# EAGLE schematic ibmpc (EAGLE 9.6.1)
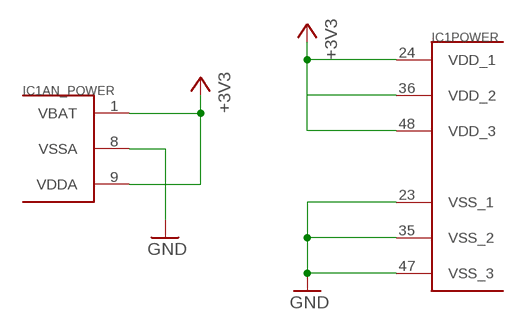
[diagram p0: schematic, sheet 1, part 1 of 2]
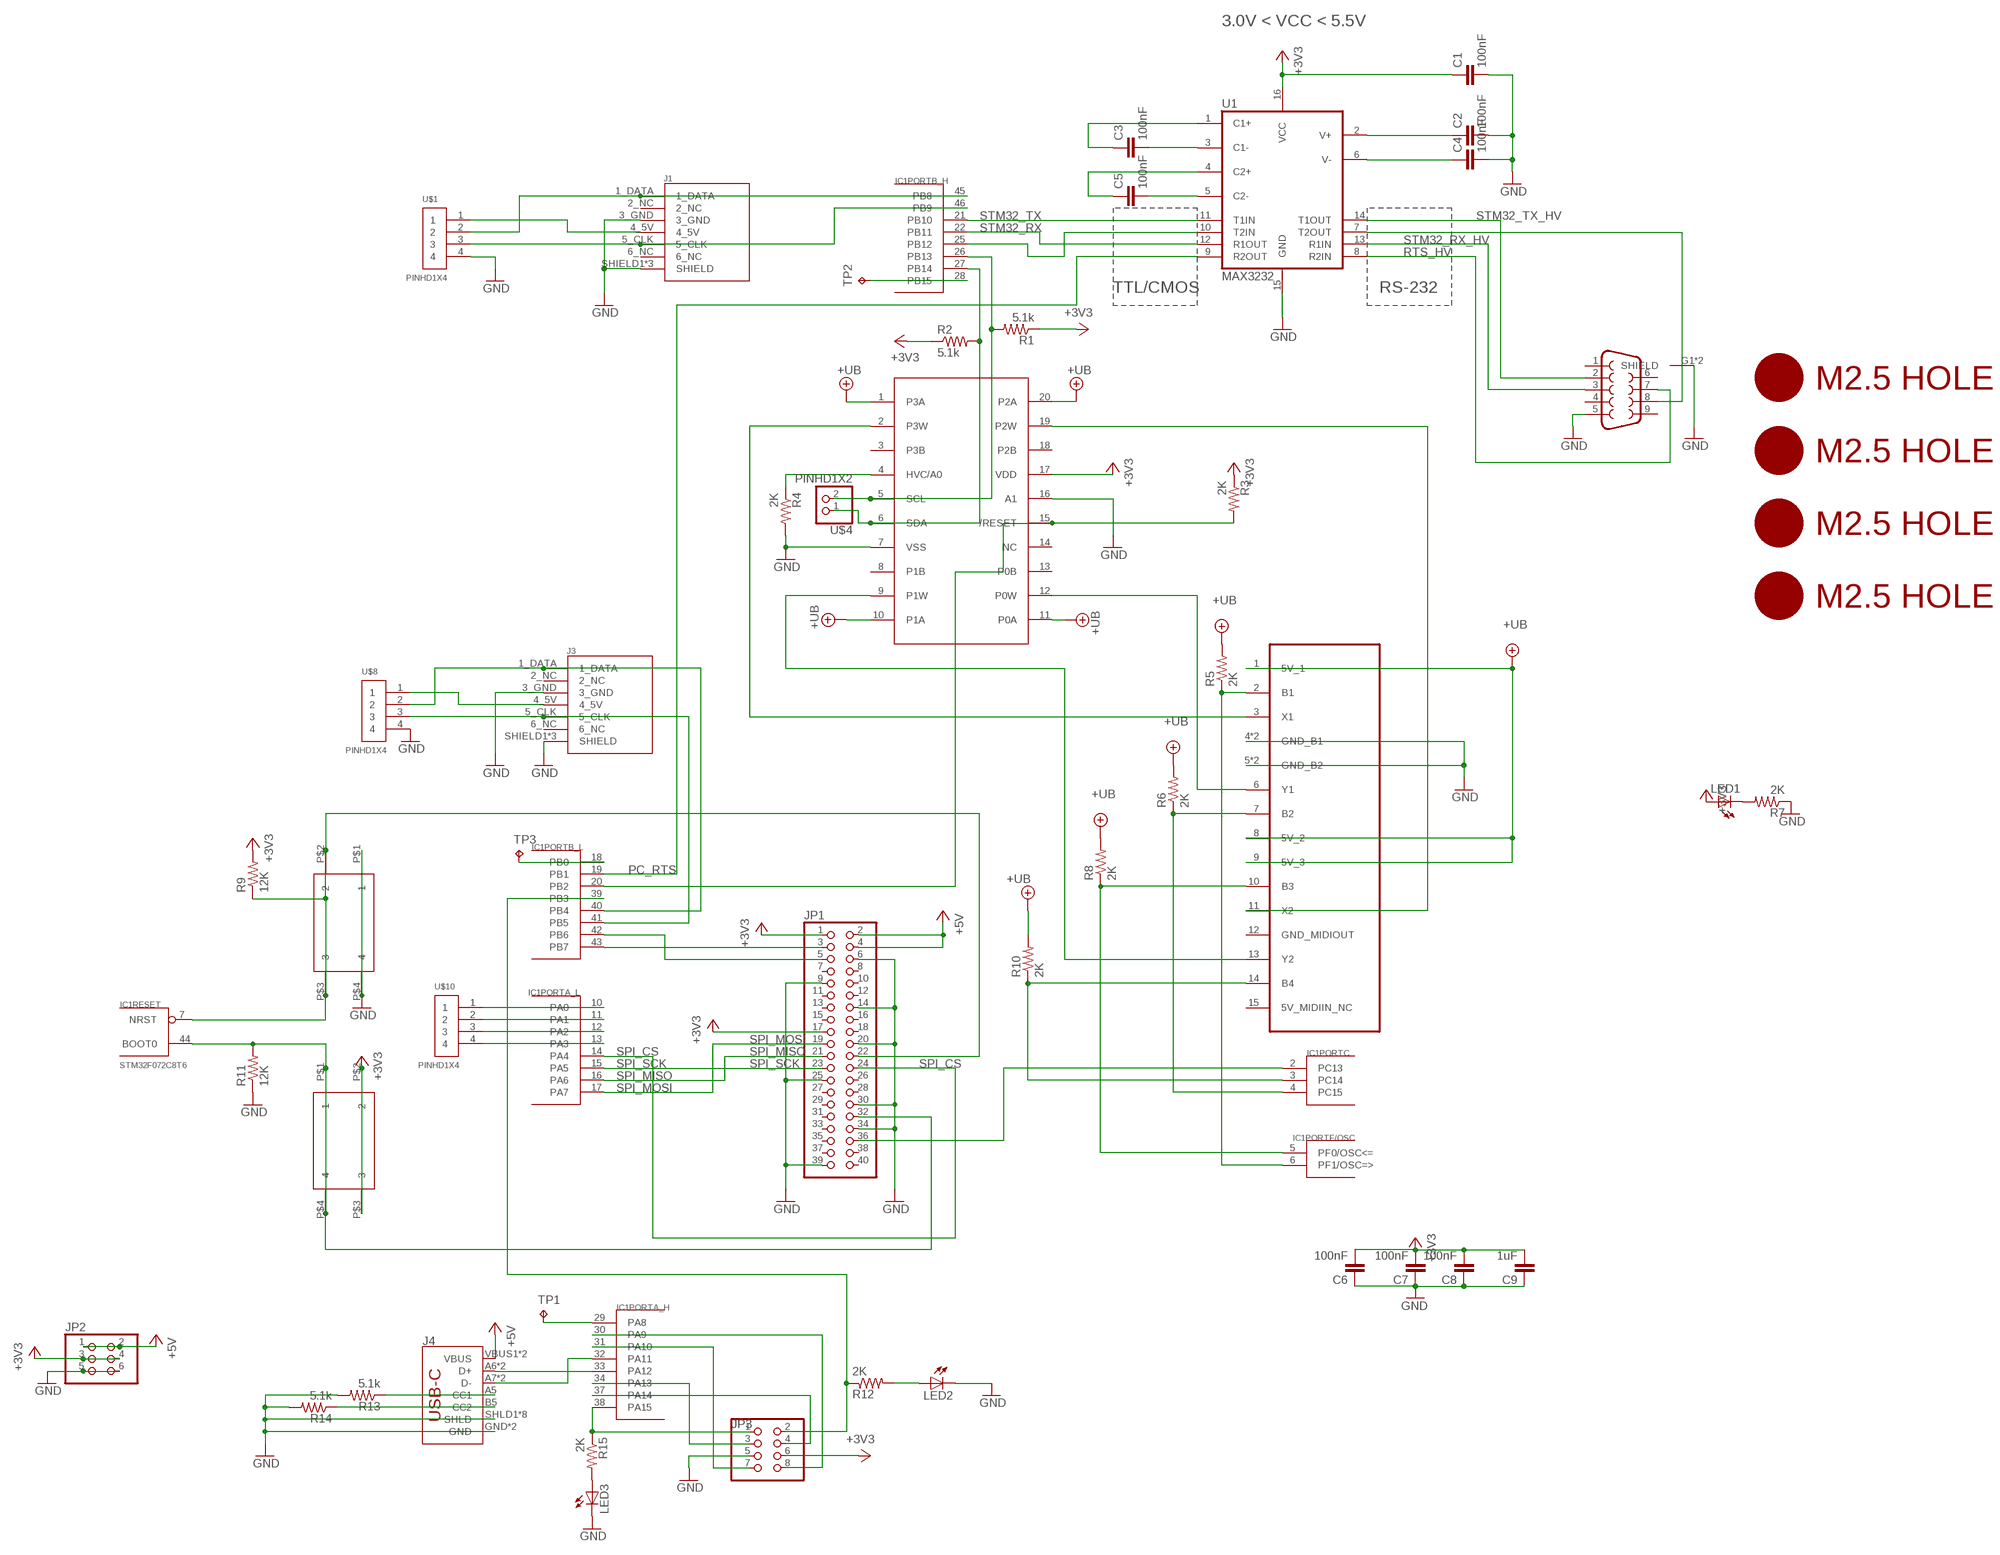
[diagram p1: schematic, sheet 1, part 2 of 2]

## Parts
C1  100nF  CAP0805  [0805@1]
C2  100nF  CAP0805  [0805@1]
C3  100nF  CAP0805  [0805@1]
C4  100nF  CAP0805  [0805@1]
C5  100nF  CAP0805  [0805@1]
C6  100nF  CAP0805  [0805@1]
C7  100nF  CAP0805  [0805@1]
C8  100nF  CAP0805  [0805@1]
C9  1uF  CAP0805  [0805@1]
IC1  STM32F072C8T6  [TQFP48]
J1  DIN7  [DIN7]
J2  DB9MALE  [DB9_MALE]
J3  DIN7  [DIN7]
J4  USB_C16PIN  [USB-C-16P]
JP1  PINHD-2X20-BIG  [2X20-BIG]
JP2  PINHD-2X3  [2X03]
JP3  PINHD-2X4  [2X04]
LED1  LEDCHIP-LED0805  [CHIP-LED0805]
LED2  LEDCHIP-LED0805  [CHIP-LED0805]
LED3  LEDCHIP-LED0805  [CHIP-LED0805]
R1  5.1k  RESISTOR0805-RES  [0805]
R2  5.1k  RESISTOR0805-RES  [0805]
R3  2K  RESISTOR0805-RES  [0805]
R4  2K  RESISTOR0805-RES  [0805]
R5  2K  RESISTOR0805-RES  [0805]
R6  2K  RESISTOR0805-RES  [0805]
R7  2K  RESISTOR0805-RES  [0805]
R8  2K  RESISTOR0805-RES  [0805]
R9  12K  RESISTOR0805-RES  [0805]
R10  2K  RESISTOR0805-RES  [0805]
R11  12K  RESISTOR0805-RES  [0805]
R12  2K  RESISTOR0805-RES  [0805]
R13  5.1k  RESISTOR0805-RES  [0805]
R14  5.1k  RESISTOR0805-RES  [0805]
R15  2K  RESISTOR0805-RES  [0805]
SW1  324_SW  [342_SWICH_FOOT]
SW2  324_SW  [342_SWICH_FOOT]
TP1  TPTP12R  [TP12R]
TP2  TPTP12R  [TP12R]
TP3  TPTP12R  [TP12R]
U1  MAX3232  MAX232SOIC16  [SO016]
U$1  PINHD1X4  [1X04-CLEANBIG]
U$2  M2.5HOLE  [M2.5HOLE]
U$3  M2.5HOLE  [M2.5HOLE]
U$4  PINHD1X2  [1X02]
U$5  MCP4451  [TSSOP20]
U$6  M2.5HOLE  [M2.5HOLE]
U$7  M2.5HOLE  [M2.5HOLE]
U$8  PINHD1X4  [1X04-CLEANBIG]
U$9  GAMEPORT_15P  [DA15]
U$10  PINHD1X4  [1X04-CLEANBIG]

## Nets
+3V3: C1.1 C6.2 C7.2 C8.2 C9.2 IC1.1(AN_POWER:VBAT) IC1.9(AN_POWER:VDDA) IC1.24(POWER:VDD_1) IC1.36(POWER:VDD_2) IC1.48(POWER:VDD_3) JP1.1 JP1.17 JP2.3 JP2.4 JP3.6 LED1.A R1.1 R2.1 R3.1 R9.2 SW2.P$2 SW2.P$3 U1.16(VCC) U$5.17(VDD)
+5V: J4.VBUS1(VBUS) J4.VBUS2(VBUS) JP1.2 JP1.4 JP2.1 JP2.2
+UB: R5.2 R6.2 R8.2 R10.2 U$5.1(P3A) U$5.10(P1A) U$5.11(P0A) U$5.20(P2A) U$9.1(5V_1) U$9.8(5V_2) U$9.9(5V_3)
C1+: C3.1 U1.1(C1+)
C1-: C3.2 U1.3(C1-)
C2+: C5.1 U1.4(C2+)
C2-: C5.2 U1.5(C2-)
GND: C1.2 C2.2 C4.2 C6.1 C7.1 C8.1 C9.1 IC1.8(AN_POWER:VSSA) IC1.23(POWER:VSS_1) IC1.35(POWER:VSS_2) IC1.47(POWER:VSS_3) J1.3_GND J1.SHIELD1(SHIELD) J1.SHIELD2(SHIELD) J1.SHIELD3(SHIELD) J2.5 J2.G1(SHIELD) J2.G2(SHIELD) J3.3_GND J3.SHIELD1(SHIELD) J3.SHIELD2(SHIELD) J3.SHIELD3(SHIELD) J4.GND J4.GND2(GND) J4.SHLD1(SHLD) J4.SHLD2(SHLD) J4.SHLD3(SHLD) J4.SHLD4(SHLD) J4.SHLD5(SHLD) J4.SHLD6(SHLD) J4.SHLD7(SHLD) J4.SHLD8(SHLD) JP1.6 JP1.9 JP1.14 JP1.20 JP1.25 JP1.30 JP1.34 JP1.39 JP2.5 JP2.6 JP3.5 LED2.C LED3.C R4.2 R7.1 R11.1 R13.2 R14.2 SW1.P$1 SW1.P$4 U1.15(GND) U$1.4 U$5.7(VSS) U$5.16(A1) U$8.4 U$9.4(GND_B1) U$9.5(GND_B2) U$9.G1(GND_B1) U$9.G2(GND_B2)
N$1: J4.A5(CC1) R13.1
N$2: LED2.A R12.2
N$3: J3.4_5V U$8.1
N$4: J1.4_5V U$1.1
N$5: IC1.41(PORTB_L:PB5) J3.5_CLK U$8.3
N$6: IC1.39(PORTB_L:PB3) JP3.2 R12.1
N$7: J4.B5(CC2) R14.1
N$8: IC1.33(PORTA_H:PA12) J4.A6(D+) J4.B6(D+)
N$9: IC1.32(PORTA_H:PA11) J4.A7(D-) J4.B7(D-)
N$10: IC1.45(PORTB_H:PB8) J1.1_DATA U$1.2
N$11: IC1.46(PORTB_H:PB9) J1.5_CLK U$1.3
N$12: IC1.31(PORTA_H:PA10) JP3.7
N$13: IC1.7(RESET:NRST) JP1.22 R9.1 SW1.P$2 SW1.P$3
N$14: IC1.30(PORTA_H:PA9) JP3.8
N$15: IC1.34(PORTA_H:PA13) JP3.3
N$16: IC1.37(PORTA_H:PA14) JP3.4
N$18: IC1.44(RESET:BOOT0) JP1.32 R11.2 SW2.P$1 SW2.P$4
N$19: IC1.4(PORTC:PC15) R6.1 U$9.7(B2)
N$20: IC1.5(PORTF/OSC:PF0/OSC<=) R8.1 U$9.10(B3)
N$21: IC1.3(PORTC:PC14) R10.1 U$9.14(B4)
N$22: IC1.42(PORTB_L:PB6) JP1.5
N$23: IC1.43(PORTB_L:PB7) JP1.3
N$24: IC1.25(PORTB_H:PB12) U1.10(T2IN)
N$25: J2.8 U1.7(T2OUT)
N$26: IC1.40(PORTB_L:PB4) J3.1_DATA U$8.2
N$27: IC1.38(PORTA_H:PA15) JP3.1 R15.1
N$28: LED3.A R15.2
N$29: LED1.C R7.2
N$31: IC1.6(PORTF/OSC:PF1/OSC=>) R5.1 U$9.2(B1)
N$32: R4.1 U$5.4(HVC/A0)
N$37: IC1.2(PORTC:PC13) JP1.36
N$38: IC1.10(PORTA_L:PA0) U$10.1
N$39: IC1.11(PORTA_L:PA1) U$10.2
N$40: IC1.12(PORTA_L:PA2) U$10.3
N$41: IC1.13(PORTA_L:PA3) U$10.4
N$42: IC1.29(PORTA_H:PA8) TP1.TP
N$43: IC1.28(PORTB_H:PB15) TP2.TP
N$44: IC1.20(PORTB_L:PB2) R3.2 U$5.15(/RESET)
N$45: IC1.18(PORTB_L:PB0) TP3.TP
PC_RTS: IC1.19(PORTB_L:PB1) U1.9(R2OUT)
POT_SCL: IC1.26(PORTB_H:PB13) R1.2 U$4.2 U$5.5(SCL)
PST_SDA: IC1.27(PORTB_H:PB14) R2.2 U$4.1 U$5.6(SDA)
RTS_HV: J2.7 U1.8(R2IN)
SPI_CS: IC1.14(PORTA_L:PA4) JP1.24
SPI_MISO: IC1.16(PORTA_L:PA6) JP1.21
SPI_MOSI: IC1.17(PORTA_L:PA7) JP1.19
SPI_SCK: IC1.15(PORTA_L:PA5) JP1.23
STM32_RX: IC1.22(PORTB_H:PB11) U1.12(R1OUT)
STM32_RX_HV: J2.3 U1.13(R1IN)
STM32_TX: IC1.21(PORTB_H:PB10) U1.11(T1IN)
STM32_TX_HV: J2.2 U1.14(T1OUT)
V+: C2.1 U1.2(V+)
V-: C4.1 U1.6(V-)
X1_W3: U$5.2(P3W) U$9.3(X1)
X2_W2: U$5.19(P2W) U$9.11(X2)
Y1_W0: U$5.12(P0W) U$9.6(Y1)
Y2_W1: U$5.9(P1W) U$9.13(Y2)
Unconnected: J1.2_NC J1.6_NC J2.1 J2.4 J2.6 J2.9 J3.2_NC J3.6_NC JP1.7 JP1.8 JP1.10 JP1.11 JP1.12 JP1.13 JP1.15 JP1.16 JP1.18 JP1.26 JP1.27 JP1.28 JP1.29 JP1.31 JP1.33 JP1.35 JP1.37 JP1.38 JP1.40 U$5.3(P3B) U$5.8(P1B) U$5.13(P0B) U$5.14(NC) U$5.18(P2B) U$9.12(GND_MIDIOUT) U$9.15(5V_MIDIIN_NC)

## Notes on the sheet
- 3.0V < VCC < 5.5V
- TTL/CMOS | RS-232

## Library data of the parts
C1-C9 = clock:CAP: Capacitor Standard 0603 ceramic capacitor, and 0.1" leaded capacitor.
IC1 = clock:STM32F072C8T6: ST STM32F072 48pin LQFP
J1 J3 = SparkFun-Connectors:DIN7: Mini-DIN7 Connector Through-hole MiniDIN 7 connector. Commonly used with Roomba products. Don't confuse this with DIN-6, which is commonly used on oldschool keyboards and mice. Here is the female version connector we sell at SparkFun: MiniDIN 7-Pin Connector <https://www.sparkfun.com/products/696> (PRT-00696); PROD_ID: CONN-08318; SF_ID: PRT-00696
J2 = SparkFun-Connectors:DB9: DB9 Connector Standard DB9 (D-Sub 9) serial connector. Can be used for CAN bus as well as RS485 and RS232. Footprint production proven. Here is the female version connector we sell at SparkFun: 9 Pin Female Serial Connector - PCB Mount <https://www.sparkfun.com/products/429> (PRT-00429) This connector has been used on the following SparkFun products: SparkFun RS232 Shifter - SMD <https://www.sparkfun.com/products/449> (PRT-00449) SparkFun RS232 Shifter SMD (No DB9) <https://www.sparkfun.com/products/8780> (PRT-08780); PROD_ID: CONN-09904
J4 = SparkFun-Connectors:USB_C: USB Type C 16Pin Connector Super Speed pins not available on the 16-pin purely SMD connector so this part is best for USB 2.0 implementations. D1 and D2 are tied together enabling D+/- no matter which way the cable is plugged into the connector. The two channel configuration pins (CC1/2) are exposed. These are normally connected to ground via 5.1k resistors but can be reconfigured for high current/high power applications.; PROD_ID: CONN-14122
JP1 = adafruit_changed:PINHD-2X20: PIN HEADER
JP2 = pinhead:PINHD-2X3: PIN HEADER
JP3 = pinhead:PINHD-2X4: PIN HEADER
LED1-LED3 = adafruit:LED: LED OSRAM: - CHIPLED LG R971, LG N971, LY N971, LG Q971, LY Q971, LO R971, LY R971 LH N974, LH R974 LS Q976, LO Q976, LY Q976 LO Q996 - Hyper CHIPLED LW Q18S LB Q993, LB Q99A, LB R99A - SideLED LS A670, LO A670, LY A670, LG A670, LP A670 LB A673, LV A673, LT A673, LW A673 LH A674 LY A675 LS A676, LA A676, LO A676, LY A676, LW A676 LS A679, LY A679, LG A679 - Hyper Micro SIDELED® LS Y876, LA Y876, LO Y876, LY Y876 LT Y87S - SmartLED LW L88C, LW L88S LB L89C, LB L89S, LG L890 LS L89K, LO L89K, LY L89K LS L896, LA L896, LO L896, LY L896 - TOPLED LS T670, LO T670, LY T670, LG T670, LP T670 LSG T670, LSP T670, LSY T670, LOP T670, LYG T670 LG T671, LOG T671, LSG T671 LB T673, LV T673, LT T673, LW T673 LH T674 LS T676, LA T676, LO T676, LY T676, LB T676, LH T676, LSB T676, LW T676 LB T67C, LV T67C, LT T67C, LS T67K, LO T67K, LY T67K, LW E67C LS E67B, LA E67B, LO E67B, LY E67B, LB E67C, LV E67C, LT E67C LW T67C LS T679, LY T679, LG T679 LS T770, LO T770, LY T770, LG T770, LP T770 LB T773, LV T773, LT T773, LW T773 LH T774 LS E675, LA E675, LY E675, LS T675 LS T776, LA T776, LO T776, LY T776, LB T776 LHGB T686 LT T68C, LB T68C - Hyper Mini TOPLED® LB M676 - Mini TOPLED Santana® LG M470 LS M47K, LO M47K, LY M47K Source: http://www.osram.convergy.de/
R1-R15 = SparkFun-Passives:RESISTOR: Resistor Basic schematic elements and footprints for 0603, 1206, and PTH resistors.
SW1 SW2 = 3pos_slide_switch_centered:324_SW
TP1-TP3 = testpad:TP: Test pad
U1 = SparkFun-DigitalIC:MAX232: RS232 Transceiver Very common IC. This is generically called 'MAX232', but works with the 3V equivalent MAX3232 generic ICs. Field tested and mother approved. Spark Fun Electronics SKU : COM-00316 (DIP) and COM-00589 (SMD); PROD_ID: IC-08171
U$1 U$8 U$10 = adafruit_changed:PINHD1X4
U$2 U$3 U$6 U$7 = f1c100s:M2.5HOLE
U$4 = adafruit_changed:PINHD1X2
U$5 = ps2:MCP4451
U$9 = ibmpc:GAMEPORT_15P

## Net classes
1 power: width 0.178 mm